# EAGLE design uv-exposure-box-main-v2 (EAGLE 6.4)
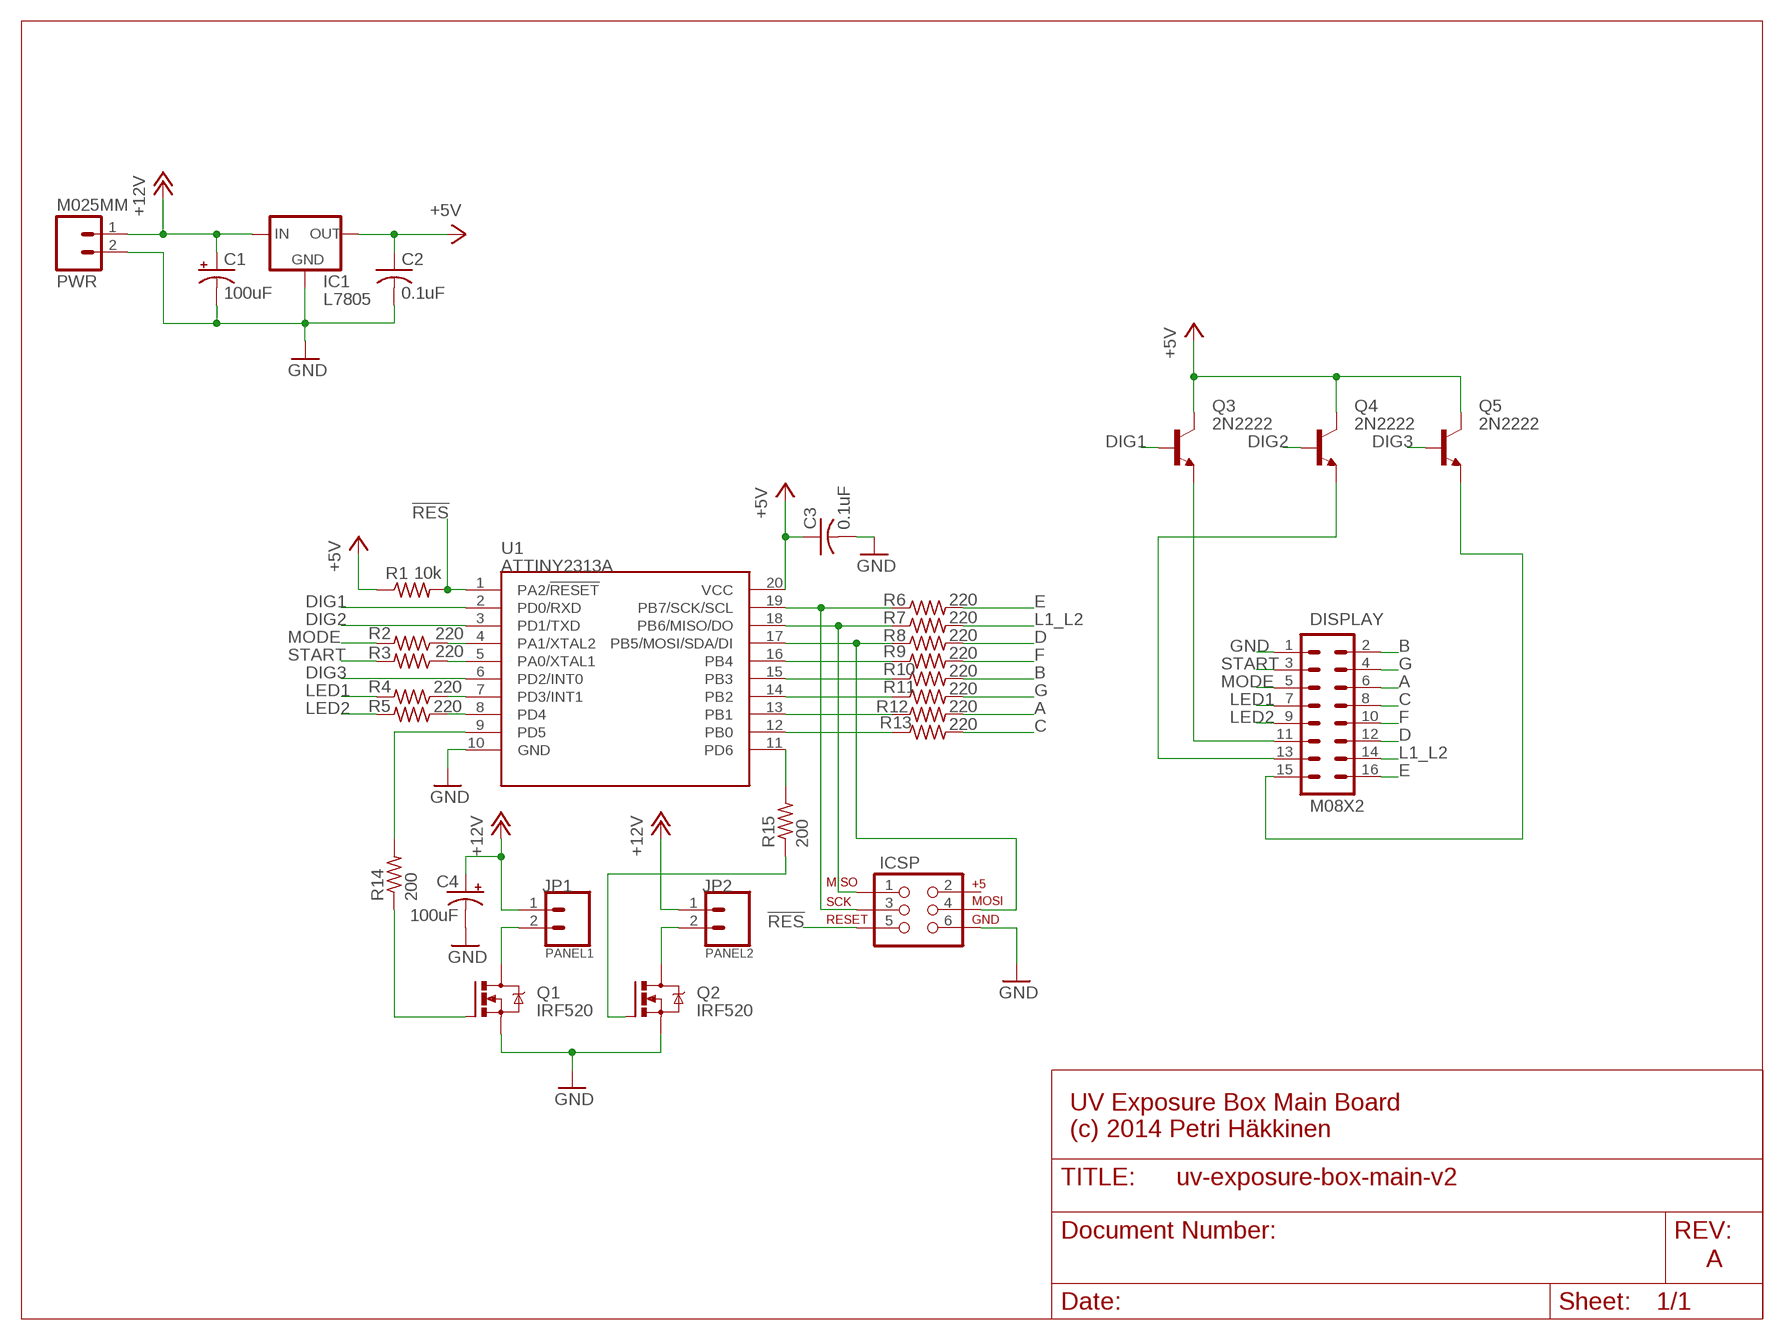
[diagram p0: schematic, sheet 1]

## Parts
C1  100uF  CPOL-USE2.5-5  [E2,5-5]
C2  0.1uF  C-US025-024X044  [C025-024X044]
C3  0.1uF  C-US025-024X044  [C025-024X044]
C4  100uF  CPOL-USE2.5-5  [E2,5-5]
DISPLAY  M08X2  [2X8]
IC1  L7805  V_REG_78XXV  [TO220-IGO]
ICSP  AVR_SPI_PRG_6PTH  [2X3]
JP1  M025MM  [SCREWTERMINAL-5MM-2]
JP2  M025MM  [SCREWTERMINAL-5MM-2]
PWR  M025MM  [SCREWTERMINAL-5MM-2]
Q1  IRF520  [TO220BV]
Q2  IRF520  [TO220BV]
Q3  2N2222  2N2222-NPN-TO92-EBC  [TO92-EBC]
Q4  2N2222  2N2222-NPN-TO92-EBC  [TO92-EBC]
Q5  2N2222  2N2222-NPN-TO92-EBC  [TO92-EBC]
R1  10k  R-US_0207/10  [0207/10]
R2  220  R-US_0207/10  [0207/10]
R3  220  R-US_0207/10  [0207/10]
R4  220  R-US_0207/10  [0207/10]
R5  220  R-US_0207/10  [0207/10]
R6  220  R-US_0207/10  [0207/10]
R7  220  R-US_0207/10  [0207/10]
R8  220  R-US_0207/10  [0207/10]
R9  220  R-US_0207/10  [0207/10]
R10  220  R-US_0207/10  [0207/10]
R11  220  R-US_0207/10  [0207/10]
R12  220  R-US_0207/10  [0207/10]
R13  220  R-US_0207/10  [0207/10]
R14  200  R-US_0207/10  [0207/10]
R15  200  R-US_0207/10  [0207/10]
U1  ATTINY2313A  ATTINY2313ADIL20  [DIL20]

## Nets
!RES: ICSP.5 R1.2 U1.1(PA2/!RESET)
+5V: C2.1 C3.1 IC1.OUT Q3.C Q4.C Q5.C R1.1 U1.20(VCC)
+12V: C1.+ C4.+ IC1.IN JP1.1 JP2.1 PWR.1
A: DISPLAY.6 R12.2
B: DISPLAY.2 R10.2
C: DISPLAY.8 R13.2
D: DISPLAY.12 R8.2
DIG1: DISPLAY.11 Q3.B Q3.E U1.2(PD0/RXD)
DIG2: Q4.B U1.3(PD1/TXD)
DIG3: Q5.B U1.6(PD2/INT0)
E: DISPLAY.16 R6.2
F: DISPLAY.10 R9.2
G: DISPLAY.4 R11.2
GND: C1.- C2.2 C3.2 C4.- DISPLAY.1 IC1.GND ICSP.6 PWR.2 Q1.S Q2.S U1.10(GND)
L1_L2: DISPLAY.14 R7.2
LED1: DISPLAY.7 R4.2
LED2: DISPLAY.9 R5.2
MODE: DISPLAY.5 R2.2
N$1: R2.1 U1.4(PA1/XTAL2)
N$2: R3.1 U1.5(PA0/XTAL1)
N$4: DISPLAY.13 Q4.E
N$5: DISPLAY.15 Q5.E
N$6: Q1.G R14.1
N$7: R15.2 U1.11(PD6)
N$9: ICSP.3 R6.1 U1.19(PB7/SCK/SCL)
N$10: ICSP.1 R7.1 U1.18(PB6/MISO/DO)
N$11: ICSP.4 R8.1 U1.17(PB5/MOSI/SDA/DI)
N$12: R9.1 U1.16(PB4)
N$13: R10.1 U1.15(PB3)
N$14: R11.1 U1.14(PB2)
N$15: R12.1 U1.13(PB1)
N$16: R13.1 U1.12(PB0)
N$26: R4.1 U1.7(PD3/INT1)
N$27: R5.1 U1.8(PD4)
N$28: R14.2 U1.9(PD5)
N$29: JP1.2 Q1.D
N$30: Q2.G R15.1
N$31: JP2.2 Q2.D
START: DISPLAY.3 R3.2
Unconnected: ICSP.2

## Notes on the sheet
- PANEL1 | PANEL2
- UV Exposure Box Main Board
  (c) 2014 Petri Häkkinen
- A

## Library data of the parts
C1 C4 = resistor:CPOL-US: POLARIZED CAPACITOR, American symbol
C2 C3 = resistor:C-US: CAPACITOR, American symbol
DISPLAY = SparkFun-Connectors:M08X2: .1" headers, two rows of 8 each
IC1 = PetenPaja:V_REG_78XX: Voltage Regulator Standard 7805 5V regulator. IGO (Input Ground Output). Spark Fun Electronics SKU : COM-00107
ICSP = SparkFun-Connectors:AVR_SPI_PRG_6: AVR ISP 6 Pin This is the reduced ISP connector for AVR programming. Common on Arduino. This footprint will take up less PCB space and can be used with a 10-pin to 6-pin adapter such as SKU: BOB-08508
JP1 JP2 PWR = SparkFun-Connectors:M02: Standard 2-pin 0.1" header. Use with - straight break away headers ( PRT-00116) - right angle break away headers (PRT-00553) - swiss pins (PRT-00743) - machine pins (PRT-00117) - female headers (PRT-00115) Molex polarized connector foot print use with: PRT-08233 with associated crimp pins and housings. 2.54_SCREWTERM for use with PRT-10571. 3.5mm Screw Terminal footprints for PRT-08084 5mm Screw Terminal footprints for use with PRT-08433
Q1 Q2 = PetenPaja:IRF520: HEXFET Power MOSFET
Q3-Q5 = transistor-neu-to92:*-NPN-: NPN Transistror
R1-R15 = resistor:R-US_: RESISTOR, American symbol
U1 = PetenPaja:ATTINY2313A: ATTINY2313A 2kB 20MHz I2C/SPI/UART

## Board
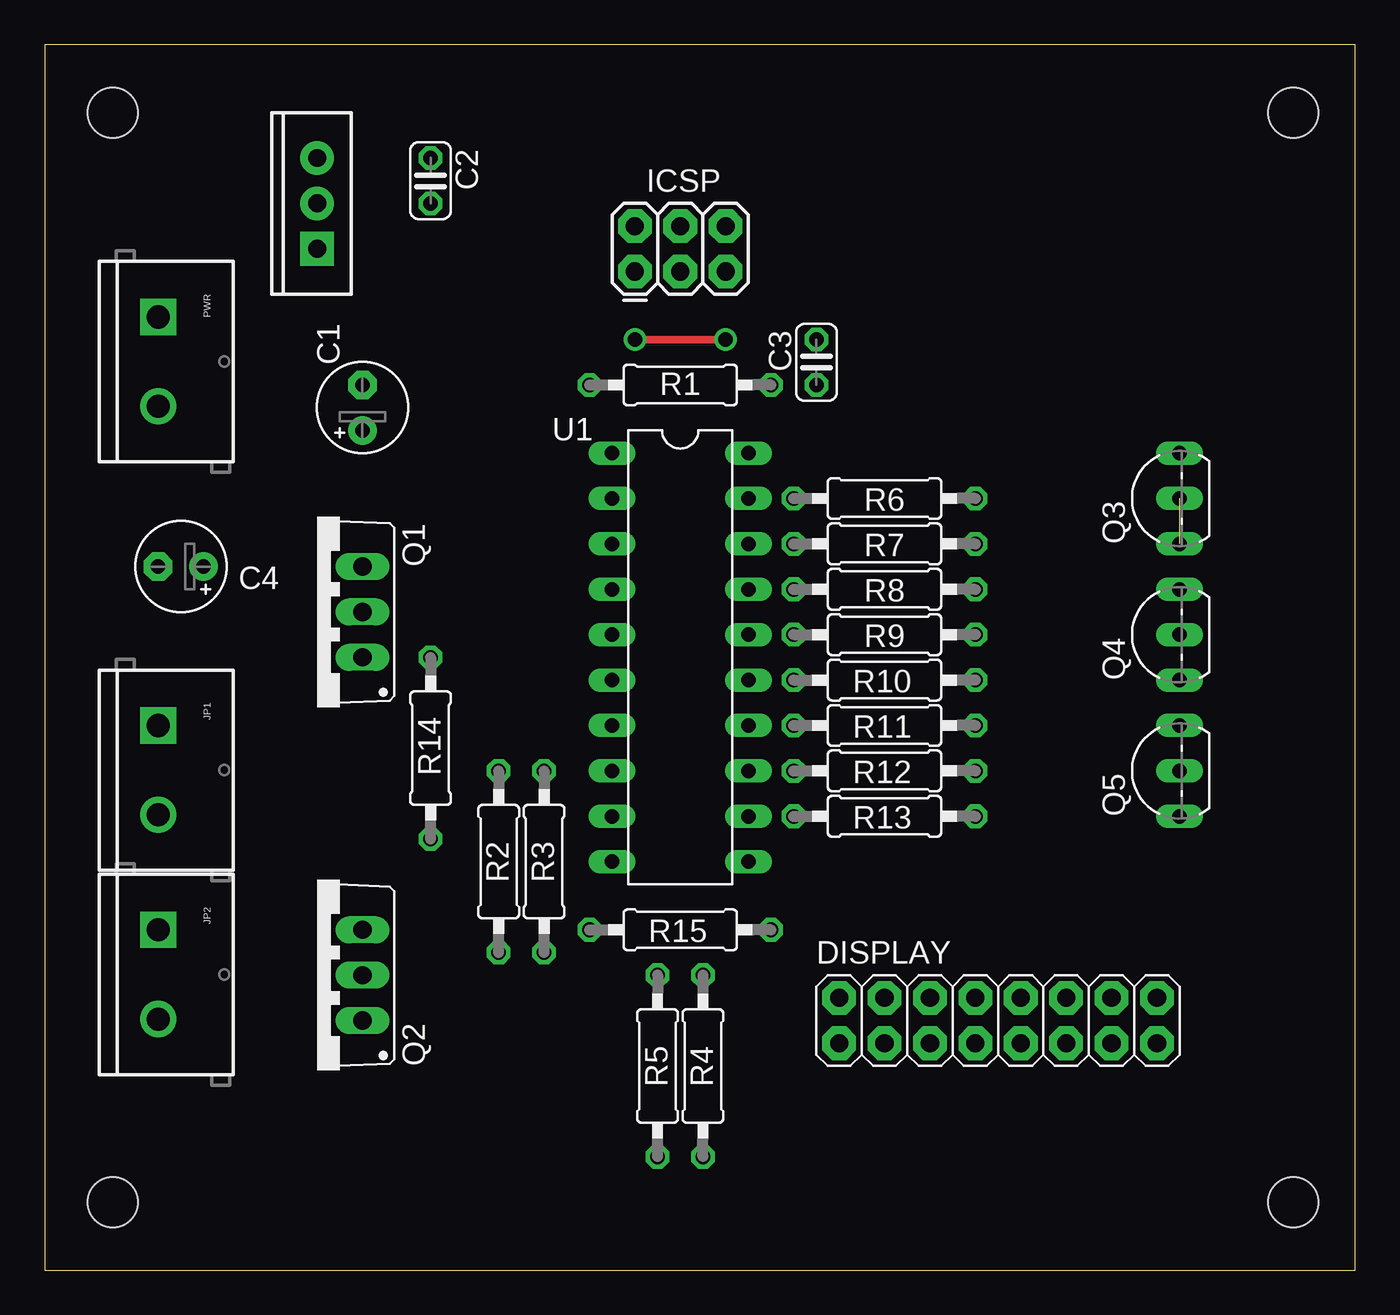
[diagram p1: board, top side]
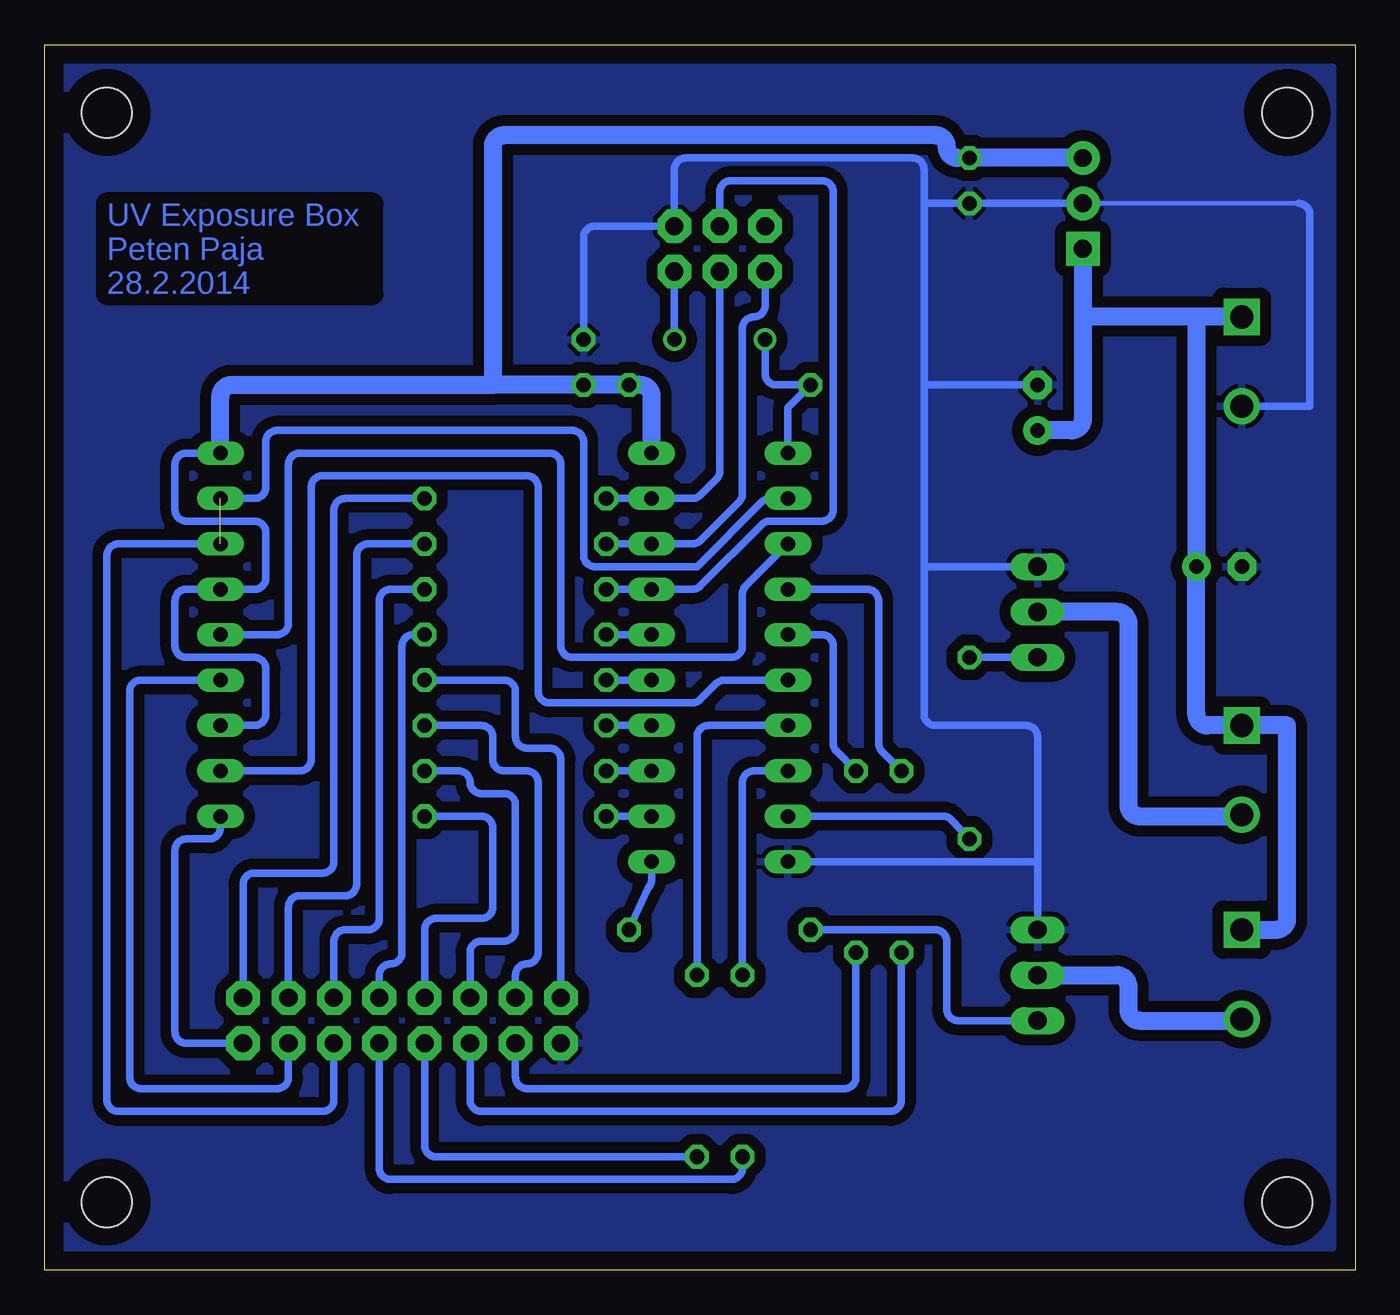
[diagram p2: board, bottom side, seen from below]

Size 73.33 x 68.57 mm. Coordinates in mm from the lower left corner, seen from the top.
Outline: 0,0 73.33,0 73.33,68.57 0,68.57 0,0
Copper layers (1*16): Top 0.035mm / dielectric 1.5mm / Bottom 0.035mm
Design rules "default": minimum track width 10mil, minimum drill 24mil, track to track 8mil, track to pad 8mil, pad to pad 8mil, via to via 8mil, smd to smd 8mil, copper to edge 40mil, drill to drill 8mil, minimum pad ring 10mil, minimum via ring 8mil, stop-mask expansion 4mil, vias tented up to drill 0mil, thermal gap 10mil
Holes 2.8 mm at 3.81,3.81 3.81,64.77 69.85,64.77 69.85,3.81

### Footprints (pad centres in the part's own frame; a part is rotated, then mirrored left to right if it is on the bottom)
E2,5-5 = drill 0.813 pad 1.6: + -1.27,0 | drill 0.813 pad 1.6 octagon: - 1.27,0
C025-024X044 = drill 0.813 octagon: 1 -1.27,0; 2 1.27,0
2X8 = drill 1.016 pad 1.88 octagon: 1 0,0; 2 0,2.54; 3 2.54,0; 4 2.54,2.54; 5 5.08,0; 6 5.08,2.54; 7 7.62,0; 8 7.62,2.54; 9 10.16,0; 10 10.16,2.54; 11 12.7,0; 12 12.7,2.54; 13 15.24,0; 14 15.24,2.54; 15 17.78,0; 16 17.78,2.54
TO220-IGO = drill 1 pad 1.88: GND 0,0; OUT 2.54,0 | drill 1 pad 1.88 square: IN -2.54,0
2X3 = drill 1.016 pad 1.88 octagon: 1 0,0; 2 0,2.54; 3 2.54,0; 4 2.54,2.54; 5 5.08,0; 6 5.08,2.54
SCREWTERMINAL-5MM-2 = drill 1.3 pad 2.032 square: 1 0,0 | drill 1.3 pad 2.032: 2 5,0
TO220BV = drill 1.016 long: D 0,-2.54; G -2.54,-2.54; S 2.54,-2.54
TO92-EBC = drill 0.813 long: B 0,-1.27; C 2.54,-1.27; E -2.54,-1.27
0207/10 = drill 0.813 octagon: 1 -5.08,0; 2 5.08,0
DIL20 = drill 0.813 long: 1 -11.43,-3.81; 2 -8.89,-3.81; 3 -6.35,-3.81; 4 -3.81,-3.81; 5 -1.27,-3.81; 6 1.27,-3.81; 7 3.81,-3.81; 8 6.35,-3.81; 9 8.89,-3.81; 10 11.43,-3.81; 11 11.43,3.81; 12 8.89,3.81; 13 6.35,3.81; 14 3.81,3.81; 15 1.27,3.81; 16 -1.27,3.81; 17 -3.81,3.81; 18 -6.35,3.81; 19 -8.89,3.81; 20 -11.43,3.81

### Placement (x,y rotation side)
C1  17.78,48.26 90 top
C2  21.59,60.96 270 top
C3  43.18,50.8 90 top
C4  7.62,39.37 180 top
DISPLAY  44.45,12.7 0 top
IC1  15.24,59.69 90 top
ICSP  33.02,55.88 0 top
JP1  6.35,30.48 270 top
JP2  6.35,19.05 270 top
PWR  6.35,53.34 270 top
Q1  15.24,36.83 90 top
Q2  15.24,16.51 90 top
Q3  62.23,43.18 90 top
Q4  62.23,35.56 90 top
Q5  62.23,27.94 90 top
R1  35.56,49.53 180 top
R2  25.4,22.86 270 top
R3  27.94,22.86 270 top
R4  36.83,11.43 270 top
R5  34.29,11.43 270 top
R6  46.99,43.18 0 top
R7  46.99,40.64 0 top
R8  46.99,38.1 0 top
R9  46.99,35.56 0 top
R10  46.99,33.02 0 top
R11  46.99,30.48 0 top
R12  46.99,27.94 0 top
R13  46.99,25.4 0 top
R14  21.59,29.21 270 top
R15  35.56,19.05 0 top
U1  35.56,34.29 270 top

### Tracks (layer width: path | path; a pad name or v marks a point on that pad's centre or on a via)
!RES  (via drill 0.8 pad 1.27)
  Top 0.406: v38.1,52.07 v33.02,52.07
  Bottom 0.406: U1.1 31.75,48.26 R1.2 32.38,49.53 arc90 33.02,50.16 v33.02,52.07 | ICSP.5 v38.1,52.07
+5V
  Bottom 0.406: Q5.C 61.59,30.48 arc-90 60.96,31.11 60.96,33.66 arc-90 61.59,34.29 65.41,34.29 arc90 66.04,34.92 66.04,37.46 arc90 65.41,38.1 Q4.C 61.59,38.1 arc-90 60.96,38.73 60.96,41.27 arc-90 61.59,41.91 65.41,41.91 arc90 66.04,42.54 66.04,45.09 arc90 65.41,45.72 Q3.C | C2.1 22.23,62.23
  Bottom 1.016: U1.20 39.37,48.89 arc-90 40.01,49.53 R1.1 C3.1 48.26,49.53 | Q3.C 63.5,48.89 arc90 62.87,49.53 48.26,49.53 | 22.23,62.23 arc90 22.86,62.86 arc-90 23.5,63.5 47.62,63.5 arc-90 48.26,62.86 48.26,49.53 | IC1.OUT C2.1
+12V
  Bottom 1.016: JP2.1 4.45,19.05 arc-90 3.81,19.69 3.81,30.48 JP1.1 8.26,30.48 arc90 8.89,31.11 C4.+ 8.89,53.34 | PWR.1 8.89,53.34 | 8.89,53.34 15.24,53.34 | 15.24,53.34 15.24,47.62 arc90 15.88,46.99 C1.+ | IC1.IN 15.24,53.34
A
  Bottom 0.406: R12.2 50.16,27.94 arc90 49.53,27.3 arc-90 48.9,26.67 47.62,26.67 arc90 46.99,26.04 46.99,19.05 arc90 47.62,18.42 48.9,18.42 arc-90 49.53,17.78 DISPLAY.6
B
  Bottom 0.406: DISPLAY.2 44.45,28.57 arc-90 45.09,29.21 46.35,29.21 arc90 46.99,29.85 46.99,32.38 arc-90 47.62,33.02 R10.2
C
  Bottom 0.406: R13.2 48.9,25.4 arc90 48.26,24.77 48.26,20.32 arc90 48.9,19.69 51.44,19.69 arc-90 52.07,19.05 DISPLAY.8
D
  Bottom 0.406: R8.2 53.98,38.1 arc-90 54.61,37.46 54.61,19.69 arc90 55.24,19.05 56.52,19.05 arc-90 57.15,18.42 DISPLAY.12
DIG1  (1 unrouted)
  Bottom 0.406: U1.2 32.76,43.18 arc-45 33.21,42.99 36.83,39.37 42.55,39.37 arc90 43.18,40 43.18,46.35 arc-90 43.81,46.99 60.33,46.99 arc-90 60.96,46.35 60.96,43.81 arc90 61.59,43.18 Q3.B | Q3.E 69.22,40.64 arc-90 69.85,40 69.85,9.53 arc-90 69.22,8.89 57.78,8.89 arc-90 57.15,9.53 DISPLAY.11
DIG2
  Bottom 0.406: U1.3 34.1,38.29 arc-45 34.29,37.84 34.29,34.92 arc90 34.92,34.29 43.81,34.29 arc90 44.45,34.92 44.45,45.09 arc-90 45.09,45.72 59.05,45.72 arc-90 59.69,45.09 59.69,36.2 arc90 60.33,35.56 Q4.B
DIG3
  Bottom 0.406: U1.6 35.3,33.02 arc-45 35.75,32.83 36.64,31.94 arc45 37.09,31.75 45.09,31.75 arc90 45.72,32.38 45.72,43.81 arc-90 46.35,44.45 57.78,44.45 arc-90 58.42,43.81 58.42,28.57 arc90 59.05,27.94 Q5.B
E
  Bottom 0.406: R6.2 56.52,43.18 arc-90 57.15,42.54 57.15,22.86 arc90 57.78,22.23 61.59,22.23 arc-90 62.23,21.59 DISPLAY.16
F
  Bottom 0.406: R9.2 52.7,35.56 arc-90 53.34,34.92 53.34,17.78 arc90 53.98,17.14 arc-90 54.61,16.51 DISPLAY.10
G
  Bottom 0.406: DISPLAY.4 46.99,16.51 arc90 46.35,17.14 arc-90 45.72,17.78 45.72,27.3 arc-90 46.35,27.94 47.62,27.94 arc90 48.26,28.57 48.26,29.85 arc-90 48.9,30.48 R11.2
GND
  Bottom 0.254: 3.17,59.69 IC1.GND
  Bottom 0.406: 3.17,59.69 arc90 2.54,59.05 2.54,48.34 PWR.2 | 24.13,49.53 24.13,59.69 | 24.13,59.69 24.13,61.59 arc-90 24.77,62.23 37.47,62.23 arc-90 38.1,61.59 ICSP.6 42.55,58.42 arc-90 43.18,57.78 C3.2 | Q1.S 24.13,39.37 | 17.78,22.86 17.78,29.85 arc-90 18.41,30.48 23.5,30.48 arc90 24.13,31.11 24.13,39.37 | 17.78,22.86 Q2.S | 24.13,39.37 24.13,49.53 | C1.- 24.13,49.53 | IC1.GND C2.2 24.13,59.69 | U1.10 17.78,22.86
  pour Bottom (isolate 0.61): 1.27,67.31 72.39,67.31 72.39,1.27 1.27,1.27
L1_L2
  Bottom 0.406: R7.2 55.24,40.64 arc-90 55.88,40 55.88,21.59 arc90 56.52,20.96 59.05,20.96 arc-90 59.69,20.32 DISPLAY.14
LED1
  Bottom 0.406: R4.2 51.44,6.35 arc90 52.07,6.98 DISPLAY.7
LED2
  Bottom 0.406: R5.2 34.29,5.71 arc90 34.92,5.08 53.98,5.08 arc90 54.61,5.71 DISPLAY.9
MODE
  Bottom 0.406: R2.2 25.4,9.53 arc90 26.04,8.89 48.9,8.89 arc90 49.53,9.53 DISPLAY.5
N$1
  Bottom 0.406: R2.1 26.48,29.02 arc45 26.67,29.47 26.67,37.46 arc-90 27.3,38.1 U1.4
N$2
  Bottom 0.406: R3.1 29.02,29.02 arc45 29.21,29.47 29.21,34.92 arc-90 29.84,35.56 U1.5
N$4
  Bottom 0.406: Q4.E 67.94,33.02 arc-90 68.58,32.38 68.58,10.79 arc-90 67.94,10.16 60.33,10.16 arc-90 59.69,10.79 DISPLAY.13
N$5
  Bottom 0.406: Q5.E 63.5,24.77 arc90 64.14,24.13 65.41,24.13 arc-90 66.04,23.5 66.04,13.33 arc-90 65.41,12.7 DISPLAY.15
N$6
  Bottom 0.406: Q1.G R14.1
N$7
  Bottom 0.406: U1.11 39.37,21.85 arc45 39.56,21.4 R15.2
N$9
  Bottom 0.406: ICSP.3 35.56,44.71 arc45 35.75,44.26 36.64,43.37 arc45 37.09,43.18 U1.19 R6.1
N$10
  Bottom 0.406: ICSP.1 33.02,53.97 arc90 33.66,53.34 arc-90 34.29,52.7 34.29,43.44 arc45 34.48,42.99 36.64,40.83 arc45 37.09,40.64 U1.18 R7.1
N$11
  Bottom 0.406: R8.1 U1.17 37.09,38.1 arc-45 36.64,38.29 33.21,41.72 arc45 32.76,41.91 29.84,41.91 arc-90 29.21,42.54 29.21,60.33 arc-90 29.84,60.96 34.92,60.96 arc-90 35.56,60.33 ICSP.4
N$12
  Bottom 0.406: U1.16 R9.1
N$13
  Bottom 0.406: U1.15 R10.1
N$14
  Bottom 0.406: U1.14 R11.1
N$15
  Bottom 0.406: U1.13 R12.1
N$16
  Bottom 0.406: U1.12 R13.1
N$20
  pour Bottom (isolate 0.61): 1.27,67.31 72.39,67.31 72.39,1.27 1.27,1.27
N$26
  Bottom 0.406: U1.7 36.2,30.48 arc-90 36.83,29.85 R4.1
N$27
  Bottom 0.406: R5.1 34.29,27.3 arc90 33.66,27.94 U1.8
N$28
  Bottom 0.406: R14.2 22.6,25.2 arc-47 23.06,25.4 U1.9
N$29
  Bottom 0.406: 6.43,25.4 arc-90 JP1.2
  Bottom 1.016: 6.43,25.4 12.06,25.4 arc90 12.7,26.04 12.7,36.2 arc-90 13.34,36.83 Q1.D
N$30
  Bottom 0.406: R15.1 23.5,19.05 arc90 22.86,18.42 22.86,14.6 arc-90 22.23,13.97 Q2.G
N$31
  Bottom 0.406: 6.43,13.97 arc-90 JP2.2
  Bottom 1.016: Q2.D 13.34,16.51 arc90 12.7,15.87 12.7,14.6 arc-90 12.06,13.97 6.43,13.97
START
  Bottom 0.406: R3.2 27.94,10.79 arc90 28.57,10.16 46.35,10.16 arc90 46.99,10.79 DISPLAY.3

### Text on the board
Bottom: UV Exposure Box / Peten Paja / 28.2.2014
tValues: +12V